# Altium schematic sheet 5_SurvBot_RCU_Sensors.SchDoc
size A4; SheetNumber: 6; SheetTotal: 8
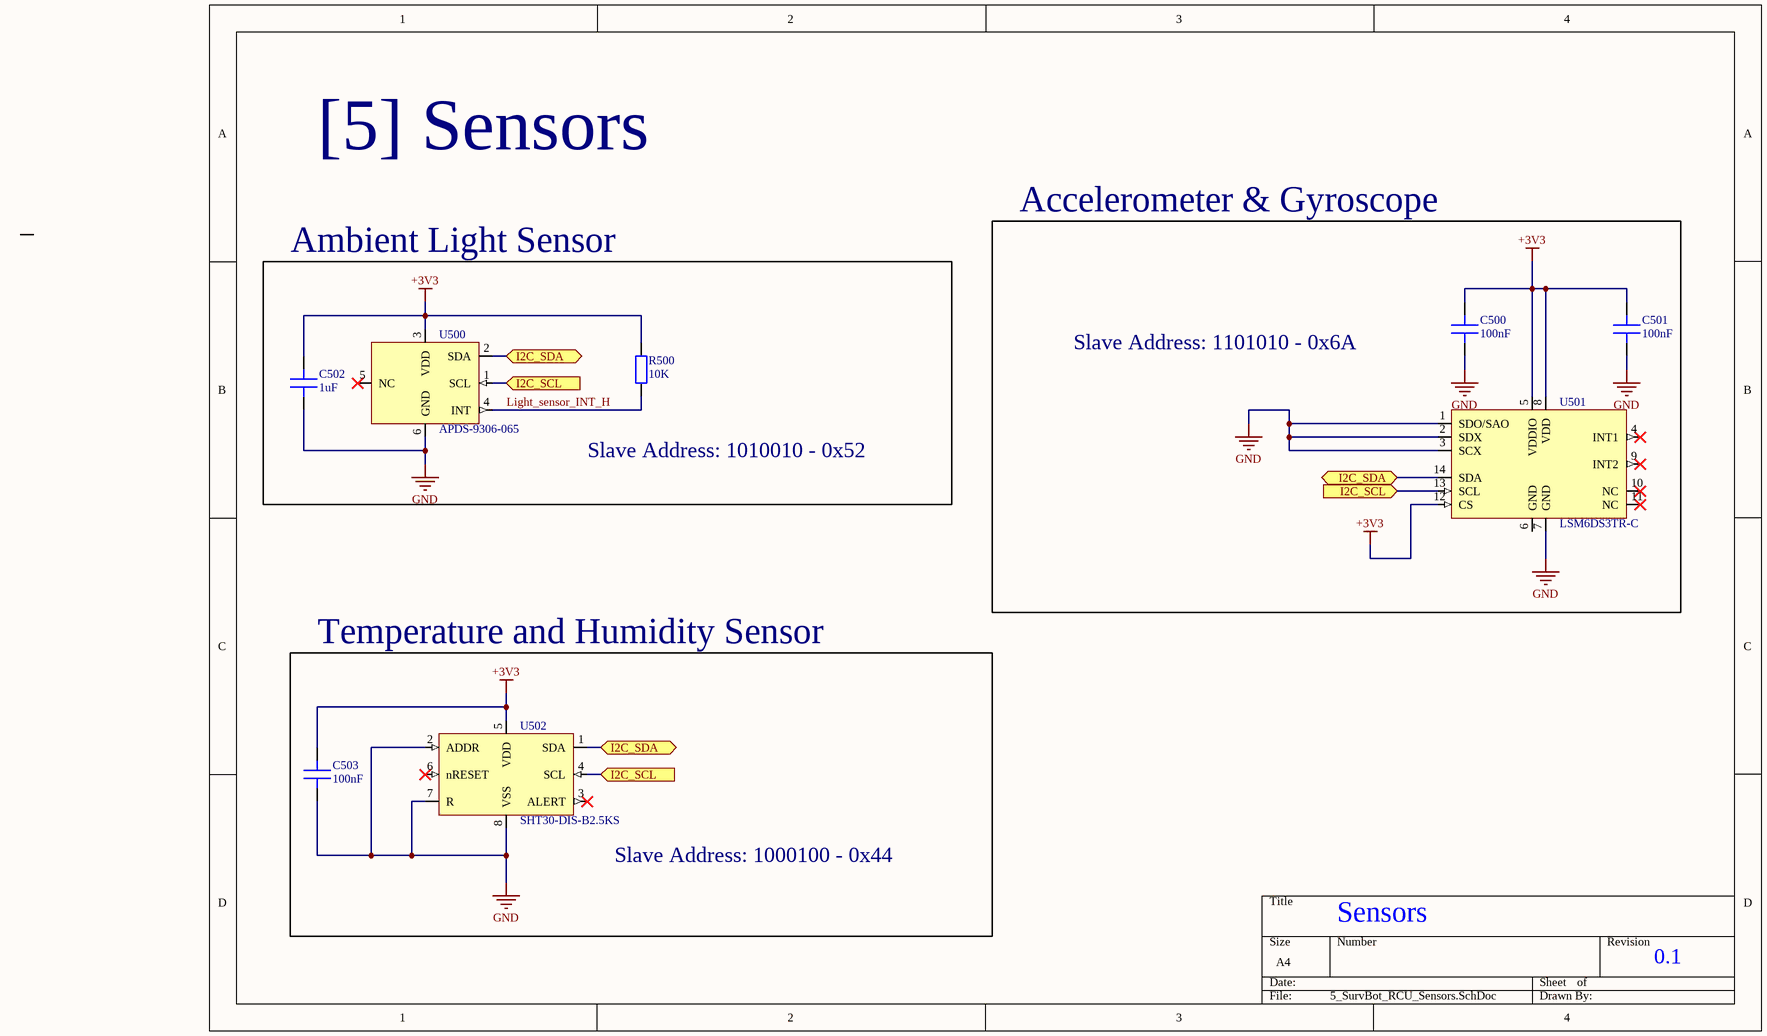
[diagram p0: 5_SurvBot_RCU_Sensors.SchDoc]

## Parts
C500  100nF  [CAP_0603]
C501  100nF  [CAP_0603]
C502  1uF  [CAP_0603]
C503  100nF  [CAP_0603]
R500  10K  [RES_0603]
U500  APDS-9306-065  [APDS-9306-065]
U501  LSM6DS3TR-C  [LGA-14_LSM6DS3TR-C]
U502  SHT30-DIS-B2.5KS  [8-VFDFN Exposed Pad]

## Blocks framed on the sheet
Accelerometer & Gyroscope: C500 C501 U501
Ambient Light Sensor: C502 R500 U500
Temperature and Humidity Sensor: C503 U502

## Ports
I2C_SCL (in, see 0_SurvBot_RCU_Overview[3C], 2_SurvBot_RCU_MCU[2B], 6_SurvBot_RCU_CurrentFeedback[1B], 6_SurvBot_RCU_CurrentFeedback[1C]), I2C_SDA (bidir, see 0_SurvBot_RCU_Overview[3C], 2_SurvBot_RCU_MCU[2B], 6_SurvBot_RCU_CurrentFeedback[1B], 6_SurvBot_RCU_CurrentFeedback[1C])

## Nets
+3V3: C500.2 C501.2 C502.2 C503.2 R500.2 U500.3(VDD) U501.5(VDDIO) U501.8(VDD) U501.12(CS) U502.5(VDD)
GND: C500.1 C501.1 C502.1 C503.1 U500.6(GND) U501.1(SDO/SAO) U501.2(SDX) U501.3(SCX) U501.7(GND) U502.2(ADDR) U502.7(R) U502.8(VSS)
I2C_SCL: U500.1(SCL) U501.13(SCL) U502.4(SCL) ; port I2C_SCL
I2C_SDA: U500.2(SDA) U501.14(SDA) U502.1(SDA) ; port I2C_SDA
Light_sensor_INT_H: R500.1 U500.4(INT)

Not connected (* = marked no-connect by the designer): U500 5(NC)*; U501 4(INT1)* 6(GND) 9(INT2)* 10(NC)* 11(NC)*; U502 3(ALERT)* 6(nRESET)*

## Notes on the sheet
- [5] Sensors
- Slave Address: 1101010 - 0x6A
- Slave Address: 1010010 - 0x52
- (near U502) Slave Address: 1000100 - 0x44
- Sensors
- 0.1

## Library data of the parts
C500 C501 C503 = CAP_100nF-50V-10%-0603: 0.1 µF ±10% 50V Ceramic Capacitor X7R 0603 (1608 Metric); Manufacturer: KEMET; Manufacturer Part #: C0603C104K5RACAUTO; Case/Package: 0603; Supplier: JLCPCB; Supplier Part #: C129621
C502 = CAP_1uF-16V-10%-0603: 1 µF ±10% 16V Ceramic Capacitor X7R 0603 (1608 Metric); Manufacturer: YAGEO; Manufacturer Part #: CC0603KRX7R7BB105; Case/Package: 0603; Supplier: JLCPCB; Supplier Part #: C106248
R500 = RES_10K-100mW-1%-0603: 10 kOhms ±1% 0.1W, 1/10W Chip Resistor 0603 (1608 Metric) Moisture Resistant Thick Film; Manufacturer: YAGEO; Manufacturer Part #: RC0603FR-0710KL; Case/Package: 0603; Supplier: JLCPCB; Supplier Part #: C98220
U500 = IC_APDS-9306-065: Optical Sensor Ambient 560nm I2C 6-SMD Module; Manufacturer: Broadcom/AVAGO; Manufacturer Part #: APDS-9306-065; Case/Package: 6-SMD Module; Supplier: JLCPCB; Supplier Part #: C2649498
U501 = IC_LSM6DS3TR-C: Accelerometer, Gyroscope, Temperature, 6 Axis Sensor I2C, SPI Output; Manufacturer: STMicroelectronics; Manufacturer Part #: LSM6DS3TR-C; Case/Package: LGA-14(2.5x3); Supplier: JLCPCB; Supplier Part #: C967633
U502 = IC_SHT30-DIS-B2.5KS: Humidity, Temperature 0 ~ 100% RH I2C ±2% RH 8 s Surface Mount; Manufacturer: Sensirion; Manufacturer Part #: SHT30-DIS-B2.5KS; Case/Package: 8-VFDFN Exposed Pad; Supplier: JLCPCB; Supplier Part #: C77361